# EAGLE schematic schematicsch (EAGLE 9.6.2)
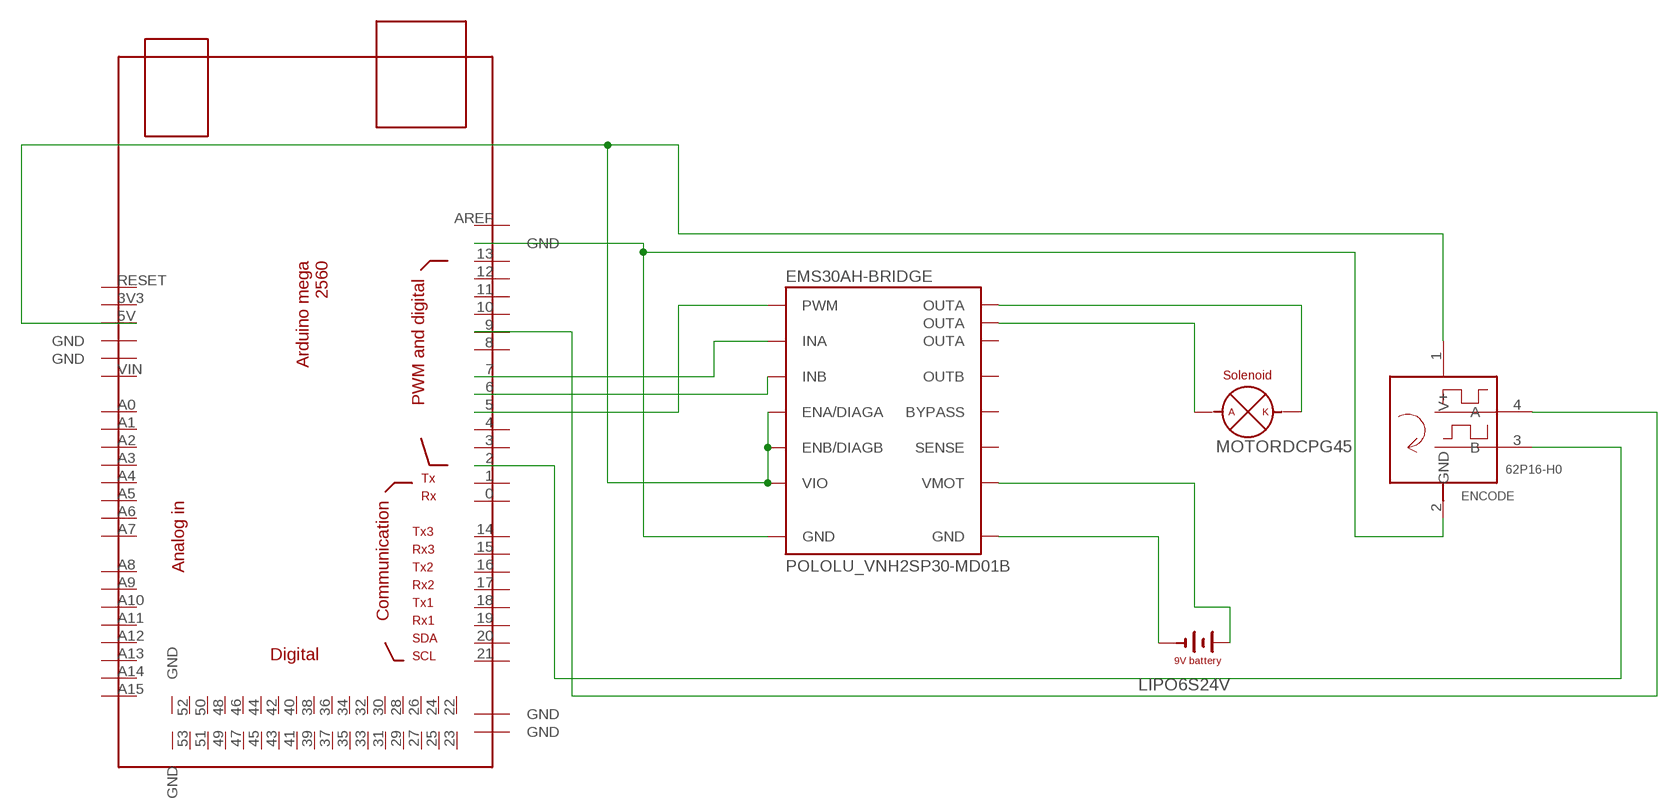
[diagram p0: schematic, sheet 1]

## Parts
EMS30AH-BRIDGE  POLOLU_VNH2SP30-MD01B  [POLOLU_MD01B_P]
ENCODE  62P16-H0  [62P]
LIPO6S24V  -9VBAT  [BAT]
MOTORDCPG45  -MOTOR  [CON2]
U$1  MEGA_DEVICE  [MEGAOUTLINE]

## Nets
GND: EMS30AH-BRIDGE.GND1(GND) ENCODE.2(GND) U$1.GND@1(GND)
N$1: EMS30AH-BRIDGE.VMOT LIPO6S24V.+
N$2: EMS30AH-BRIDGE.GND2(GND) LIPO6S24V.-
N$3: EMS30AH-BRIDGE.PWM U$1.5
N$4: EMS30AH-BRIDGE.OUTA2(OUTA) MOTORDCPG45.P$1(+)
N$5: EMS30AH-BRIDGE.OUTA3(OUTA) MOTORDCPG45.P$2(-)
N$8: ENCODE.4(A) U$1.9
N$9: EMS30AH-BRIDGE.INB U$1.6
N$10: EMS30AH-BRIDGE.INA U$1.7
N$11: ENCODE.3(B) U$1.2
V+: EMS30AH-BRIDGE.ENA(ENA/DIAGA) EMS30AH-BRIDGE.ENB(ENB/DIAGB) EMS30AH-BRIDGE.VIO ENCODE.1(V+) U$1.5V
Unconnected: EMS30AH-BRIDGE.OUTA1(OUTA) EMS30AH-BRIDGE.OUTB EMS30AH-BRIDGE.SENSE U$1.0 U$1.1 U$1.3 U$1.3V3 U$1.4 U$1.8 U$1.10 U$1.11 U$1.12 U$1.13 U$1.14 U$1.15 U$1.16 U$1.17 U$1.18 U$1.19 U$1.20 U$1.21 U$1.22 U$1.23 U$1.24 U$1.25 U$1.26 U$1.27 U$1.28 U$1.29 U$1.30 U$1.31 U$1.32 U$1.33 U$1.34 U$1.35 U$1.36 U$1.37 U$1.38 U$1.39 U$1.40 U$1.41 U$1.42 U$1.43 U$1.44 U$1.45 U$1.46 U$1.47 U$1.48 U$1.49 U$1.50 U$1.51 U$1.52 U$1.53 U$1.A0 U$1.A1 U$1.A2 U$1.A3 U$1.A4 U$1.A5 U$1.A6 U$1.A7 U$1.A8 U$1.A9 U$1.A10 U$1.A11 U$1.A12 U$1.A13 U$1.A14 U$1.A15 U$1.AREF U$1.GND@2(GND) U$1.GND@3(GND) U$1.GND@4(GND) U$1.GND@5(GND) U$1.GND@6(GND) U$1.GND@7(GND) U$1.RESET U$1.VIN

## Power pins joined to a net without a drawn wire
BYPASS: EMS30AH-BRIDGE.BYP(BYPASS)

## Library data of the parts
EMS30AH-BRIDGE = _hhn_Pololu:POLOLU_VNH2SP30-MD01B: POLOLU VNH2SP30 MD01B Motor Driver Carrier Board With Current Sense Output DEVICE VERSIONS * [none]: plated auxilary OUTA connections -U : non-plated auxilary OUTA connections -X : no symbol-pins for OUTx, BYPASS, VMOT, GND2 (drawing elements only) SOURCE www.pololu.com/ SPECS Operatingg voltage VMOT 5.5 .. 16 V Logic Voltage VIO 5 V typ. MOSFET on-resistance (per leg): 19 mOhm max. Max PWM frequency 20 kHz Current sense 0.13 V/A Over-voltage shutoff 16 V min. / 19 V typ. Logic input high threshold 3.25 V min. Time to overheat at 20 A 35 s Time to overheat at 15 A 150 s Current for infinite run time 14 A Author: Dipl.-Ing. FH Rainer Bayer
ENCODE = rotary-encoder:62P*0
LIPO6S24V = tango:-9VBAT
MOTORDCPG45 = tango:-MOTOR
U$1 = ArduinoMegaOutline:MEGA_DEVICE: mega card as device